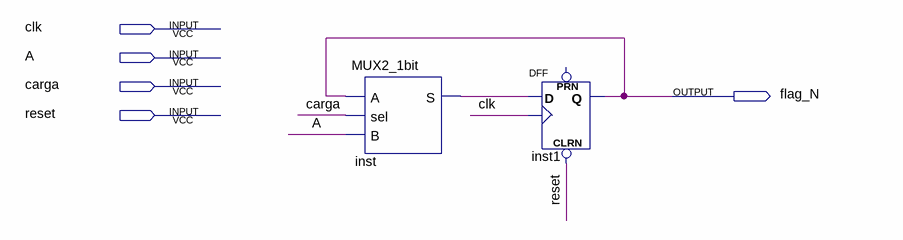
[diagram p0: schematic sheet]
// Quartus schematic FLAG_N.bdf as structural Verilog: 2 symbols, 5 pins
module FLAG_N (
  input  clk,
  input  A,
  input  carga,
  input  reset,
  output flag_N
);

  wire inst_s;

  MUX2_1bit inst (.A(flag_N), .sel(carga), .B(A), .S(inst_s));
  DFF inst1 (.CLRN(reset), .CLK(clk), .D(inst_s), .Q(flag_N));  // open: PRN
endmodule
